# Altium schematic sheet choke_current_meas.SchDoc
size A4; Date: 04.12.2023; ApprovedBy: Cezary Worek; Author: Mikołaj Pichita; CompanyName: AGH University of Science and Technology; SheetNumber: 7; SheetTotal: 16
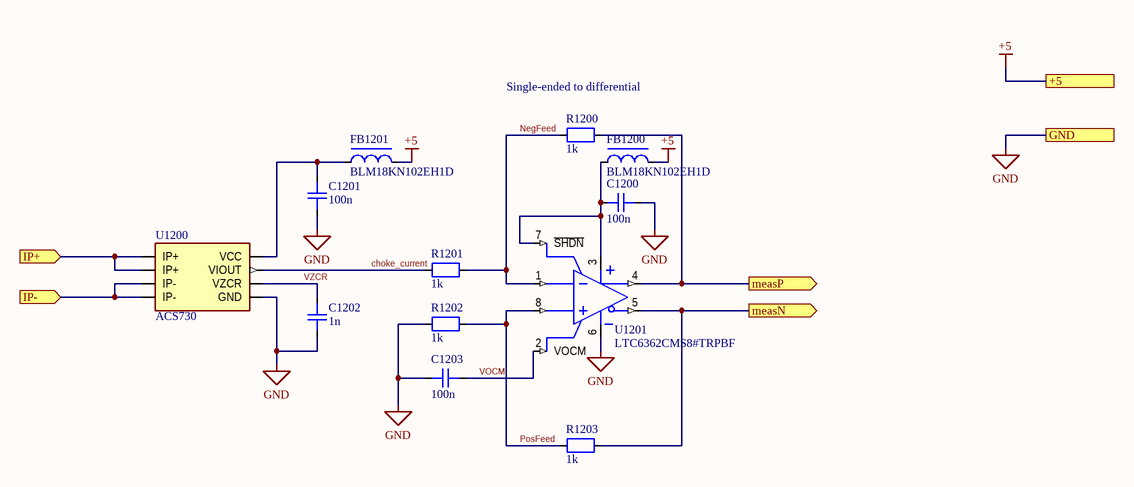
[diagram p0: choke_current_meas.SchDoc]

## Parts
C1200  100n  [CAP0603]
C1201  100n  [CAP0603]
C1202  1n  [CAP0603]
C1203  100n  [CAP0603]
FB1200  BLM18KN102EH1D  [RES0603]
FB1201  BLM18KN102EH1D  [RES0603]
R1200  1k  [RES0603]
R1201  1k  [RES0603]
R1202  1k  [RES0603]
R1203  1k  [RES0603]
U1200  ACS730  [SOIC127P600X175-8N]
U1201  LTC6362CMS8#TRPBF  [LT-MS8-8_M]

## Ports
+5 (see full_bridge[3D], current_sense_shunt[4A], full_bridge[1C], isolator[1B], measurements[1C], microcontroller[1C], power_supply[2B], voltage_sense[4A]), GND (see full_bridge[3D], current_sense_shunt[4A], full_bridge[1D], isolator[1B], measurements[1C], microcontroller[1C], power_supply[1B], voltage_sense[4B]), IP+ (in, see full_bridge[3D]), IP- (in, see full_bridge[3D]), measN (out, see full_bridge[2D]), measP (out, see full_bridge[2D])

## Nets
+5: FB1200.2 FB1201.2 ; port +5
GND: C1200.1 C1201.1 C1202.1 C1203.2 R1202.2 U1200.5(GND) U1201.6(V-) ; port GND
choke_current: R1201.2 U1200.7(VIOUT)
IP+: U1200.1(IP+) U1200.2(IP+) ; port IP+
IP-: U1200.3(IP-) U1200.4(IP-) ; port IP-
measN: R1203.1 U1201.5(-OUT) ; port measN
measP: R1200.1 U1201.4(+OUT) ; port measP
NegFeed: R1200.2 R1201.1 U1201.1(-IN)
PosFeed: R1202.1 R1203.2 U1201.8(+IN)
VOCM: C1203.1 U1201.2(VOCM)
VZCR: C1202.2 U1200.6(VZCR)
NetC1200_2: C1200.2 FB1200.1 U1201.3(V+) U1201.7(~{SHDN})
NetC1201_2: C1201.2 FB1201.1 U1200.8(VCC)

## Notes on the sheet
- (near R1200) Single-ended to differential
- Nazwa projektu
- Nazwa dokumentu
- Nazwa firmy:
- Autor:
- Osoba sprawdzająca:
- Data:

## Library data of the parts
C1200-C1203 = Capacitor: Value: *; HelpURL: *; MPN: *; Supplier: *; SupplierPartNumber: *; Supplier 1: Mouser
  C1200 C1201 C1203: Supplier Part Number 1: 581-06035C104KAT2A
  C1202: Supplier Part Number 1: 581-0603YC102J4T2A
FB1200 FB1201 = Ferrite Bead: Value: *; HelpURL: *; MPN: *; Supplier: *; SupplierPartNumber: *; Supplier 1: Mouser; Supplier Part Number 1: 81-BLM18KN102EH1D
R1200-R1203 = Resistor: Value: *; HelpURL: *; MPN: *; Supplier: *; SupplierPartNumber: *; Supplier 1: Mouser; Supplier Part Number 1: 652-CR0603FX-1001ELF
U1200 = ACS730: 1 MHz Bandwidth, Galvanically Isolated Current Sensor IC in Small Footprint SOIC8 Package; Value: *; HelpURL: *; MPN: *; Supplier: *; SupplierPartNumber: *; Supplier 1: Mouser; Supplier Part Number 1: 250-730KLCTR20ABT
U1201 = LTC6362: Single Channel, Precision, Low Power Differential Operational Amplifier / SAR ADC Driver, RRIO, 180 MHz Typical GBW, 45 V/us Typical SR, 2.8 to 5.25 V, 8-Pin SOP (MS8-8), Commercial, Pb-Free, Reel; Manufacturer: Linear Technology; Vs Max (V): 5.25; GBW (MHz) Typical: 180; Is (mA) Typical: 0.9; SR (V/us) Typical: 45; Vos (mV) Typical: 0.05; Vs Min (V): 2.8; Channels (#): 1; ComponentLink3URL: http://cds.linear.com/docs/en/packaging/05081610_G_SO8.pdf; PartNumber: LTC6362CMS8#TRPBF; ComponentLink2Description: Datasheet; DatasheetVersion: Rev. A; PackageVersion: Rev G; ComponentLink2URL: http://cds.linear.com/docs/en/datasheet/6362fa.pdf; RoHS: Pb-Free; Packing: Reel; Linear Technology Part Number: LTC6362; ComponentLink1URL: http://www.linear.com/; Mounting Technology: Surface Mount; ComponentLink1Description: Manufacturer URL; Type: DIFF; RevisionNote: URLs updated; ComponentLink3Description: Package Specification; PackageReference: LT-MS8-8; PackageDescription: 8-Lead Plastic Small Outline, Body 3.9 x 4.9 mm, Pitch 1.27 mm; Supplier 1: Mouser; Supplier Part Number 1: 584-LTC6362CMS8TRPBF